# Altium schematic sheet footprint.SchDoc
size A4
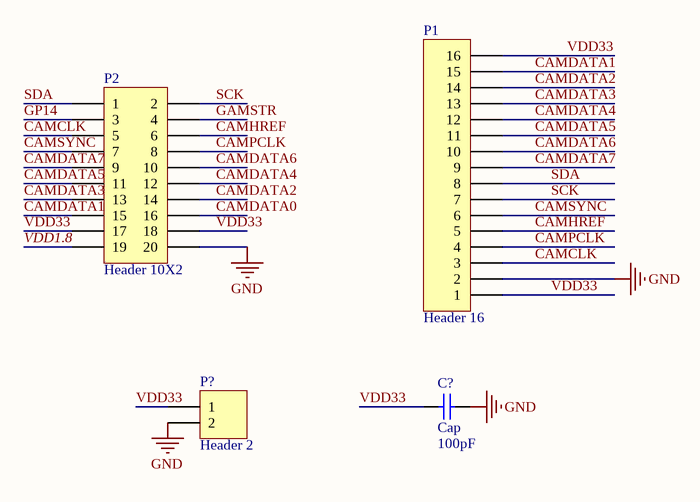
[diagram p0: footprint.SchDoc]

## Parts
C?  Cap  value 100pF  [1812]
P1  Header 16  [FPC16]
P2  Header 10X2  [H20X1 2.0]
P?  Header 2  [HDR1X2]

## Nets
GND: C?.2 P1.2 P2.20 P?.2
CAMCLK: P1.3 P2.5
CAMDATA0: P2.16
CAMDATA1: P1.15 P2.15
CAMDATA2: P1.14 P2.14
CAMDATA3: P1.13 P2.13
CAMDATA4: P1.12 P2.12
CAMDATA5: P1.11 P2.11
CAMDATA6: P1.10 P2.10
CAMDATA7: P1.9 P2.9
CAMHREF: P1.5 P2.6
CAMPCLK: P1.4 P2.8
CAMSYNC: P1.6 P2.7
GAMSTR: P2.4
GP14: P2.3
SCK: P1.7 P2.2
SDA: P1.8 P2.1
VDD1.8: P2.19
VDD33: C?.1 P1.1 P1.16 P2.17 P2.18 P?.1

## Library data of the parts
C? = Cap: Capacitor; Published: 8-Jun-2000; LatestRevisionDate: 17-Jul-2002; LatestRevisionNote: Re-released for DXP Platform.; PackageReference: RAD-0.3; Publisher: Altium Limited
P1 = Header 16: Header, 16-Pin; LatestRevisionDate: 17-Jul-2002; LatestRevisionNote: Re-released for DXP Platform.; Publisher: Altium Limited
P2 = Header 10X2: Header, 10-Pin, Dual row; LatestRevisionDate: 17-Jul-2002; LatestRevisionNote: Re-released for DXP Platform.; Publisher: Altium Limited
P? = Header 2: Header, 2-Pin; LatestRevisionDate: 17-Jul-2002; LatestRevisionNote: Re-released for DXP Platform.; Publisher: Altium Limited